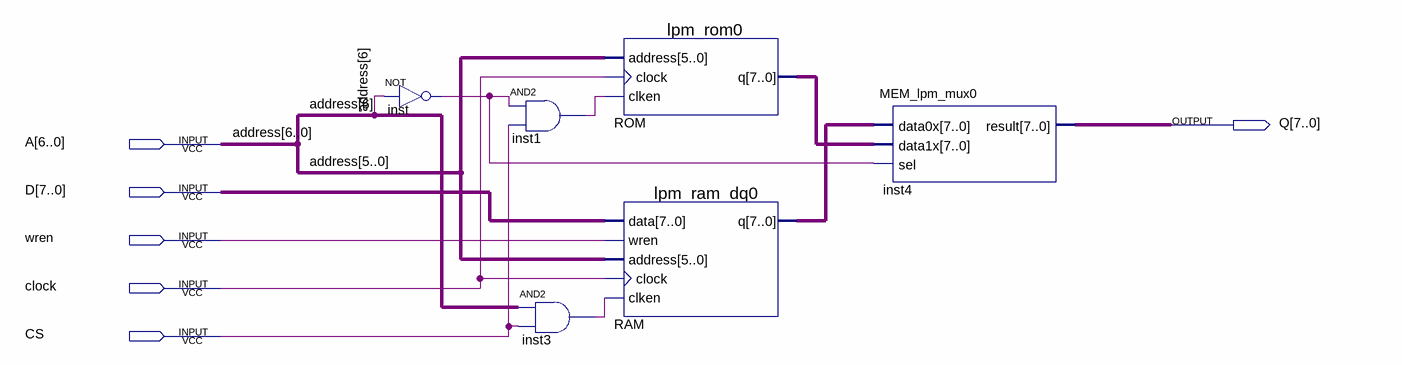
[diagram p0: schematic sheet]
// Quartus schematic MEM.bdf as structural Verilog: 6 symbols, 6 pins
module MEM (
  input  [6:0] A,
  input  [7:0] D,
  input  wren,
  input  clock,
  input  CS,
  output [7:0] Q
);

  wire inst1_out, inst3_out, inst_out;
  wire [7:0] RAM_q, ROM_q;

  not inst (inst_out, A[6]);
  and inst1 (inst1_out, inst_out, CS);
  and inst3 (inst3_out, A[6], CS);
  lpm_rom0 ROM (.address(A[5:0]), .clock(clock), .clken(inst1_out), .q(ROM_q));
  lpm_ram_dq0 RAM (.data(D), .wren(wren), .address(A[5:0]), .clock(clock), .clken(inst3_out), .q(RAM_q));
  MEM_lpm_mux0 inst4 (.data0x(RAM_q), .data1x(ROM_q), .sel(inst_out), .result(Q));

  // Other names for the same wires on the sheet: address[6:0] = A
endmodule
